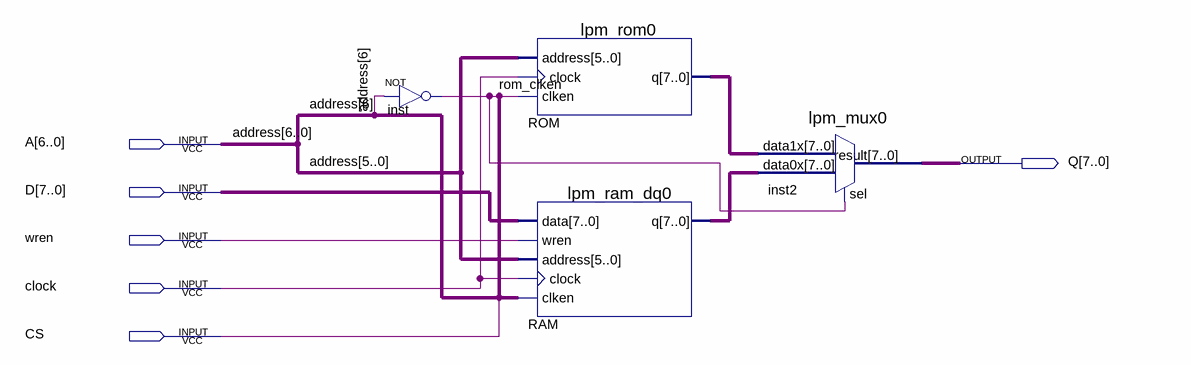
[diagram p0: schematic sheet]
// Quartus schematic MEM.bdf as structural Verilog: 4 symbols, 6 pins
module MEM (
  input  [6:0] A,
  input  [7:0] D,
  input  wren,
  input  clock,
  input  CS,
  output [7:0] Q
);

  wire rom_clken;
  wire [7:0] RAM_q, ROM_q;

  not inst (rom_clken, A[6]);
  lpm_rom0 ROM (.address(A[5:0]), .clock(clock), .clken(rom_clken), .q(ROM_q));
  lpm_ram_dq0 RAM (.data(D), .wren(wren), .address(A[5:0]), .clock(clock), .clken(A[6]), .q(RAM_q));
  lpm_mux0 inst2 (.data1x(ROM_q), .data0x(RAM_q), .sel(rom_clken), .result(Q));

  // Other names for the same wires on the sheet: address[6:0] = A
endmodule
